# Altium schematic sheet EFR32BG13_INTERCONNECTS.SchDoc
size A4; Author: Induja N/Karthik R; SheetNumber: 7; SheetTotal: 7
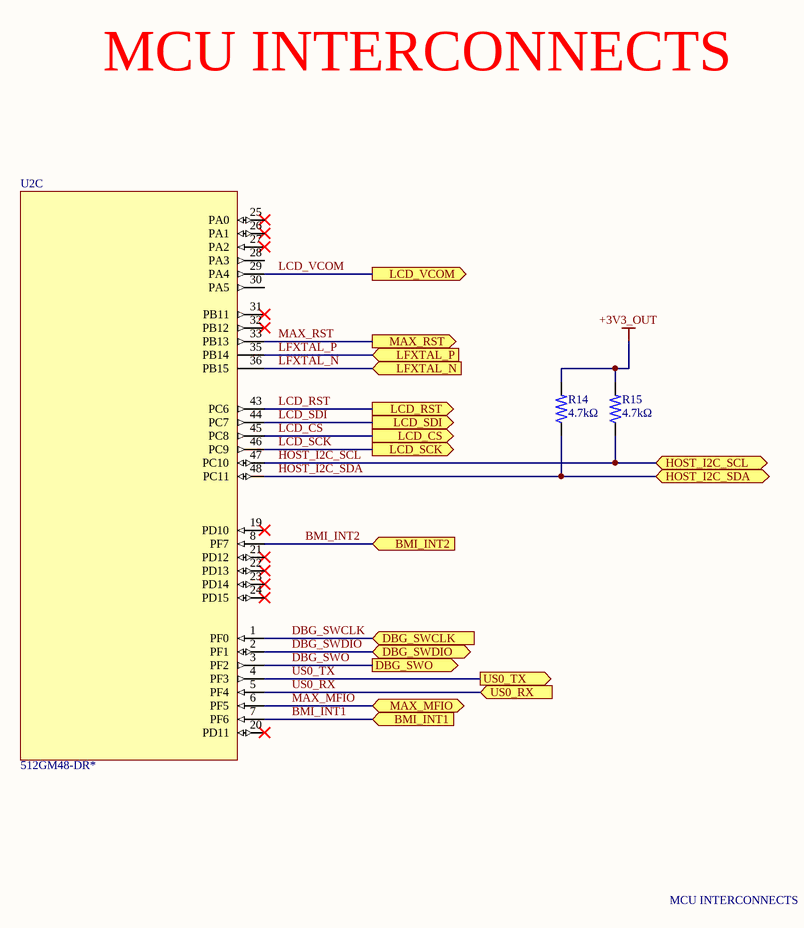
[diagram p0: EFR32BG13_INTERCONNECTS.SchDoc]

## Parts
R14  value 4.7kΩ  [RES_0603_1608X06]  (hidden comment: RES 4.7K 0603)
R15  value 4.7kΩ  [RES_0603_1608X06]  (hidden comment: RES 4.7K 0603)
U2  512GM48-DR*  [QFN_48_7x7]  (part C of 3)

## Ports
BMI_INT1 (in, see COMMUNICATION[2B]), BMI_INT2 (in, see COMMUNICATION[2B]), DBG_SWCLK (in, see COMMUNICATION[2C]), DBG_SWDIO (bidir, see COMMUNICATION[1C]), DBG_SWO (out, see COMMUNICATION[2C]), HOST_I2C_SCL (bidir, see COMMUNICATION[1B]), HOST_I2C_SDA (bidir, see COMMUNICATION[1B]), LCD_CS (out, see LCD[2B]), LCD_RST (out, see LCD[2B]), LCD_SCK (out, see LCD[2B]), LCD_SDI (out, see LCD[2B]), LCD_VCOM (out, see LCD[2B]), LFXTAL_N (in, see EFR32G13_POWER_RESET[3B]), LFXTAL_P (in, see EFR32G13_POWER_RESET[3B]), MAX_MFIO (bidir, see HEART_RATE[1B]), MAX_RST (out, see HEART_RATE[1B]), US0_RX (in, see COMMUNICATION[2C]), US0_TX (out, see COMMUNICATION[1C])

## Nets
+3V3_OUT: R14.2 R15.2
BMI_INT1: U2.7(PF6) ; port BMI_INT1
BMI_INT2: U2.8(PF7) ; port BMI_INT2
DBG_SWCLK: U2.1(PF0) ; port DBG_SWCLK
DBG_SWDIO: U2.2(PF1) ; port DBG_SWDIO
DBG_SWO: U2.3(PF2) ; port DBG_SWO
HOST_I2C_SCL: R15.1 U2.47(PC10) ; port HOST_I2C_SCL
HOST_I2C_SDA: R14.1 U2.48(PC11) ; port HOST_I2C_SDA
LCD_CS: U2.45(PC8) ; port LCD_CS
LCD_RST: U2.43(PC6) ; port LCD_RST
LCD_SCK: U2.46(PC9) ; port LCD_SCK
LCD_SDI: U2.44(PC7) ; port LCD_SDI
LCD_VCOM: U2.29(PA4) ; port LCD_VCOM
LFXTAL_N: U2.36(PB15) ; port LFXTAL_N
LFXTAL_P: U2.35(PB14) ; port LFXTAL_P
MAX_MFIO: U2.6(PF5) ; port MAX_MFIO
MAX_RST: U2.33(PB13) ; port MAX_RST
US0_RX: U2.5(PF4) ; port US0_RX
US0_TX: U2.4(PF3) ; port US0_TX

Not connected (* = marked no-connect by the designer): U2 19(PD10)* 20(PD11)* 21(PD12)* 22(PD13)* 23(PD14)* 24(PD15)* 25(PA0)* 26(PA1)* 27(PA2)* 28(PA3) 30(PA5) 31(PB11)* 32(PB12)*

## Notes on the sheet
- MCU INTERCONNECTS

## Library data of the parts
R14 R15 = RES 4.7K 0603: Fixed Resistor, Metal Glaze/thick Film, 0.1W, 4700ohm, 75V, 1% +/-Tol, 100ppm/Cel, Surface Mount, 0603; Manufacturer: Yageo; Manufacturer Part Number: RC0603FR-074K7L; Additional Feature: LASER TRIMMABLE; Power: 100mW; Rated Temperature: 70°C; Temperature Coefficient: 100ppm/°C; Package Height: 0.45mm; Package Length: 1.6mm; Package Width: 0.8mm; Supplier: Digikey; Supplier Part Number: 311-4.70KHRCT-ND; RoHS: Yes; Category: Chip SMD Resistors; Stock: 2101497; Pricing: 1=0.1, 10=0.019, 50=0.0112, 100=0.0093, 500=0.00622, 1000=0.00532, 5000=0.00382, 10000=0.00335, 25000=0.00287, 35000=0.00278, 50000=0.00257, 125000=0.00232 (USD); Mounting Technology: Surface Mount; Pins: 2; Package Shape: Rectangular; Case/Package: 0603; Terminal Finish: Nickel; Min Operating Temperature: -55°C; Max Operating Temperature: 155°C; Tolerance: 1%; JESD-609 Code: e3; Resistor Type: FIXED RESISTOR; Construction: Chip; Package Style: SMTMeter; Packaging: Tape and Reel; Technology: METAL GLAZE/THICK FILM; Termination: Wraparound; Working Voltage: 75V; Reach SVHC Compliant: Yes; RoHS Compliant: Yes; ComponentLink1URL: https://datasheet.ciiva.com:443/pdfs/VipMasterIC/IC/YAGO/YAGO-S-A0008145938/YAGO-S-A0008145938-1.pdf?src-supplier=IHS+Markit; ComponentLink1Description: https://datasheet.ciiva.com:443/pdfs/VipMasterIC/IC/YAGO/YAGO-S-A0008145938/YAGO-S-A0008145938-1.pdf?src-supplier=IHS+Markit; ComponentLink2URL: https://datasheet.ciiva.com/46440/1868787-46440909.pdf?src-supplier=Element14; ComponentLink2Description: https://datasheet.ciiva.com/46440/1868787-46440909.pdf?src-supplier=Element14; ComponentLink3URL: https://datasheet.ciiva.com/7660/38590-7660794.pdf?src-supplier=Element14; ComponentLink3Description: https://datasheet.ciiva.com/7660/38590-7660794.pdf?src-supplier=Element14; ComponentLink4URL: https://datasheet.ciiva.com/7746/1868787-7746365.pdf?src-supplier=Element14; ComponentLink4Description: https://datasheet.ciiva.com/7746/1868787-7746365.pdf?src-supplier=Element14; ComponentLink5URL: https://datasheet.ciiva.com/7746/1738695-7746366.pdf?src-supplier=Element14; ComponentLink5Description: https://datasheet.ciiva.com/7746/1738695-7746366.pdf?src-supplier=Element14; ComponentLink6URL: https://datasheet.ciiva.com/22747/443971-22747528.pdf?src-supplier=Element14; ComponentLink6Description: https://datasheet.ciiva.com/22747/443971-22747528.pdf?src-supplier=Element14; Supplier 1: DigiKey; Supplier Part Number 1: 311-4.70KHRDKR-ND
U2 = EFR32BG13P732F512GM48-DR: Blue Gecko QFN48 2.4 G 19 dB BLE/Proprietary 512 kB 64 kB(RAM) 31GPIO; Manufacturer: Silicon Labs; Manufacturer Lifecycle Status: FULL PRODUCTION; Flash Memory Size: 512kB; Max Supply Voltage: 3.8V; Min Supply Voltage: 1.8V; Number of Digital IO: 31; Number of I2C Channels: 2; Number of SPI Channels: 3; Number of UART Channels: 8; Number of USART Channels: 4; Operating Supply Voltage: 3.3V; RAM Size: 64kB; Supplier: DigiKey; Supplier Part Number: 336-EFR32BG13P732F512GM48-DRCT-ND; Manufacturer Part Number: EFR32BG13P732F512GM48-DR; RoHS: Compliant; Category: System on Chip (SoC); Stock: 8802; Pricing: 1=7.38, 10=6.396, 25=6.0548, 100=5.586, 250=5.30508, 500=5.10674, 1000=4.91994 (USD); Height - Seated (Max): 900µm; Length: 7mm; Lifecycle Status: Production; Max Operating Temperature: 85°C; Min Operating Temperature: -40°C; Number of GPIO: 31; Number of Terminals: 48; Terminal Pitch: 500µm; Width: 7mm; ComponentLink1URL: https://datasheet.octopart.com:443/EFR32BG13P732F512GM48-DR-Silicon-Labs-datasheet-180782262.pdf?src-supplier=IHS; ComponentLink1Description: https://datasheet.octopart.com:443/EFR32BG13P732F512GM48-DR-Silicon-Labs-datasheet-180782262.pdf?src-supplier=IHS; ComponentLink2URL: https://datasheet.octopart.com:443/EFR32BG13P732F512GM48-DR-Silicon-Labs-datasheet-150822224.pdf?src-supplier=Silicon+Labs; ComponentLink2Description: https://datasheet.octopart.com:443/EFR32BG13P732F512GM48-DR-Silicon-Labs-datasheet-150822224.pdf?src-supplier=Silicon+Labs; ComponentLink3URL: https://datasheet.octopart.com:443/EFR32BG13P732F512GM48-DR-Silicon-Labs-datasheet-142345357.pdf?src-supplier=Silicon+Labs+SCT; ComponentLink3Description: https://datasheet.octopart.com:443/EFR32BG13P732F512GM48-DR-Silicon-Labs-datasheet-142345357.pdf?src-supplier=Silicon+Labs+SCT; ComponentLink4URL: https://datasheet.octopart.com:443/EFR32BG13P732F512GM48-DR-Silicon-Labs-datasheet-150822225.pdf?src-supplier=Farnell; ComponentLink4Description: https://datasheet.octopart.com:443/EFR32BG13P732F512GM48-DR-Silicon-Labs-datasheet-150822225.pdf?src-supplier=Farnell